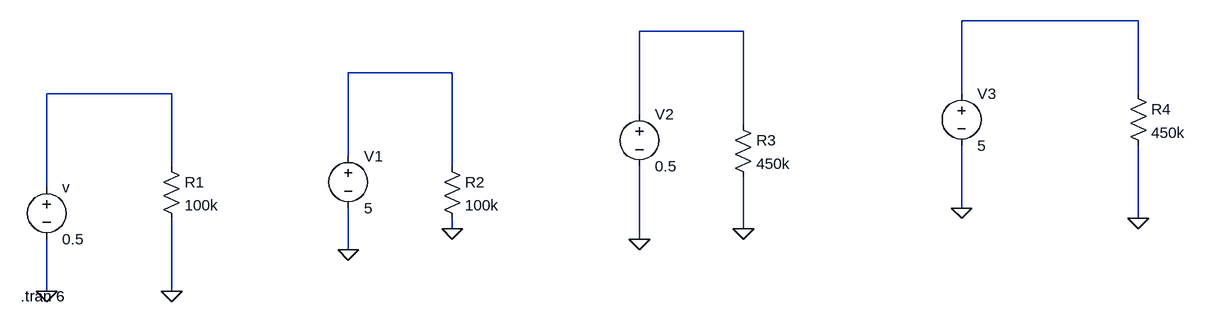
[diagram p0: schematic Draft1-DC.asc]
Draft1-DC.asc, the LTspice schematic file:
Version 4.1
SHEET 1 1840 680
WIRE 1760 -160 1488 -160
WIRE 1152 -144 992 -144
WIRE 704 -80 544 -80
WIRE 272 -48 80 -48
WIRE 1488 -48 1488 -160
WIRE 1760 -48 1760 -160
WIRE 992 -16 992 -144
WIRE 1152 0 1152 -144
WIRE 544 48 544 -80
WIRE 272 64 272 -48
WIRE 704 64 704 -80
WIRE 80 96 80 -48
WIRE 1488 128 1488 32
WIRE 1760 144 1760 32
WIRE 704 160 704 144
WIRE 1152 160 1152 80
WIRE 992 176 992 64
WIRE 544 192 544 128
WIRE 80 256 80 176
WIRE 272 256 272 144
FLAG 272 256 0
FLAG 80 256 0
FLAG 704 160 0
FLAG 544 192 0
FLAG 1152 160 0
FLAG 992 176 0
FLAG 1760 144 0
FLAG 1488 128 0
SYMBOL voltage 80 80 R0
WINDOW 123 0 0 Left 0
WINDOW 39 0 0 Left 0
SYMATTR InstName v
SYMATTR Value 0.5
SYMBOL res 256 48 R0
SYMATTR InstName R1
SYMATTR Value 100k
SYMBOL voltage 544 32 R0
WINDOW 123 0 0 Left 0
WINDOW 39 0 0 Left 0
SYMATTR InstName V1
SYMATTR Value 5
SYMBOL res 688 48 R0
SYMATTR InstName R2
SYMATTR Value 100k
SYMBOL voltage 992 -32 R0
WINDOW 123 0 0 Left 0
WINDOW 39 0 0 Left 0
SYMATTR InstName V2
SYMATTR Value 0.5
SYMBOL voltage 1488 -64 R0
WINDOW 123 0 0 Left 0
WINDOW 39 0 0 Left 0
SYMATTR InstName V3
SYMATTR Value 5
SYMBOL res 1136 -16 R0
SYMATTR InstName R3
SYMATTR Value 450k
SYMBOL res 1744 -64 R0
SYMATTR InstName R4
SYMATTR Value 450k
TEXT 40 264 Left 2 !.tran 6

The netlist it stands for:
* Draft1-DC.asc
v N004 0 0.5
R1 N004 0 100k
V1 N003 0 5
R2 N003 0 100k
V2 N002 0 0.5
V3 N001 0 5
R3 N002 0 450k
R4 N001 0 450k
.tran 6
.backanno
.end